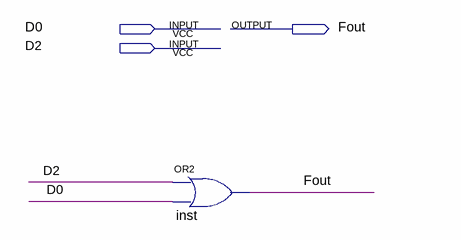
[diagram p0: schematic sheet]
// Quartus schematic F-Logic.bdf as structural Verilog: 1 symbols, 3 pins
module \F-Logic  (
  input  D0,
  input  D2,
  output Fout
);

  or inst (Fout, D2, D0);
endmodule
